# Altium schematic sheet Copy of Header-Female-2.54_1x8.schdoc
size 127 x 101 mm
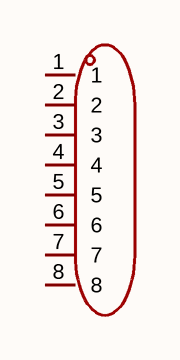
[diagram p0: Copy of Header-Female-2.54_1x8.schdoc]

## Parts
P?  2.54-1*8p母环保  [HDR-TH_8P-P2.54-V-F]  (value not drawn)

## Nets

Not connected (* = marked no-connect by the designer): P? 1 2 3 4 5 6 7 8

## Library data of the parts
P? = 2.54-1*8p母环保: Holes Structure:1x8P Pitch:2.54mm Row Spacing:- Circular Hole / Square Hole:Square Hole Mounting Type:Through Hole Number of Rows:1 Number of Positions:8P Current Rating:3A Holes Direction:Top Insulation Height:8.5mm Contact Material:Brass Contact Plating; Manufacturer: BOOMELE(博穆精密); Symbol: Header-Female-2.54_1x8; AddInBom: yes; ModelId: 6ab1dac21d924c3d8eea0dfa46d42ff5; ModelTransform: 819.723,98.425,0,0,0,0,0,0,-118.11; Holes Structure: 1x8P; Pitch: 2.54mm; Number of Positions: 8P; Current Rating: 3A; Holes Direction: Top; PIN Length: 3.2mm; LCSC Part Name: 1x8P 间距:2.54mm 直插; SupplierPart: C27438; ManufacturerPart: 2.54-1*8P母环保; Supplier Footprint: 插件,P=2.54mm; JLCPCB Part Class: Extended Part; Datasheet: https://item.szlcsc.com/datasheet/2.54-1*8P%25E6%25AF%258D%25E7%258E%25AF%25E4%25BF%259D/28187.html; Supplier: LCSC; ConvertToPcb: yes; FootprintName: HDR-TH_8P-P2.54-V-F; ModelName: HDR-TH_8P-P2.54-V-F; Row Spacing: -; Circular Hole / Square Hole: Square Hole; Mounting Type: Through Hole; Number of Rows: 1; Insulation Height: 8.5mm; Contact Material: Brass; Contact Plating: Gold; Operating Temperature: -55℃~+105℃